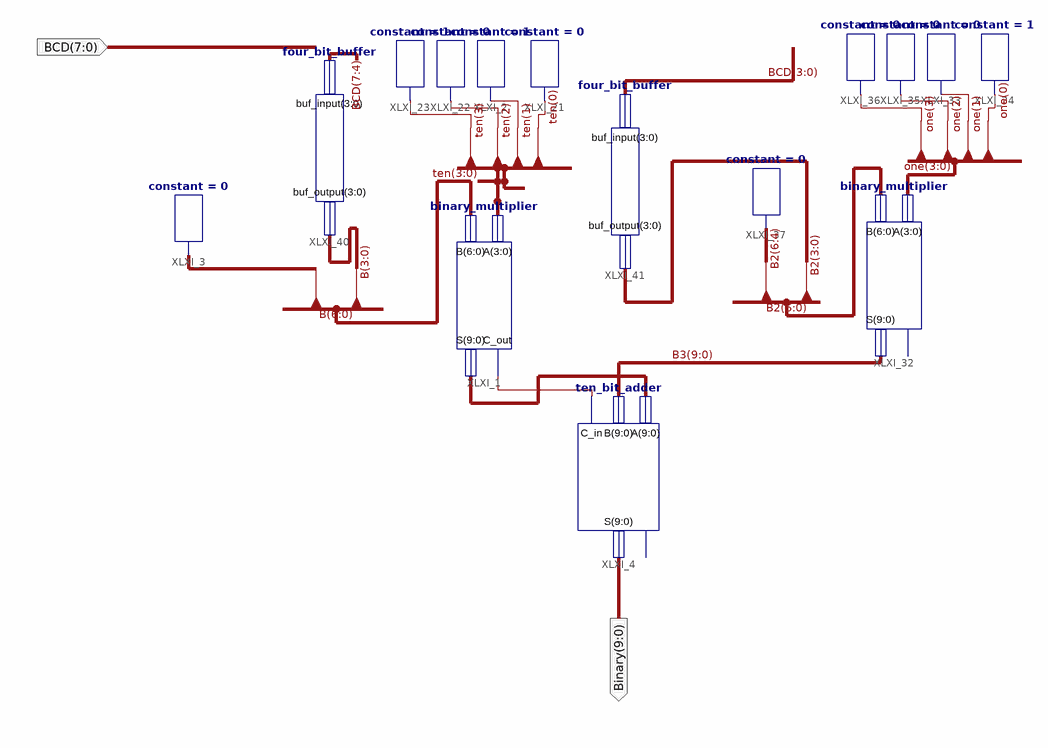
[diagram p0: schematic sheet 1]
// Xilinx ISE schematic BCD_to_Binary_decoder.sch (artix7) as structural Verilog: 15 symbols, 2 ports
module BCD_to_Binary_decoder (
  input  [7:0] BCD,
  output [9:0] Binary
);

  wire XLXN_10;
  wire [3:0] one, ten;
  wire [6:0] B, B2;
  wire [9:0] B3, XLXN_9;

  constant #(.CValue("1")) XLXI_2 (.O(ten[1]));
  constant #(.CValue("0")) XLXI_3 (.O(B[6:4]));
  binary_multiplier XLXI_1 (.A(ten), .B(B), .C_out(XLXN_10), .S(XLXN_9));
  constant #(.CValue("0")) XLXI_21 (.O(ten[0]));
  constant #(.CValue("0")) XLXI_22 (.O(ten[2]));
  constant #(.CValue("1")) XLXI_23 (.O(ten[3]));
  ten_bit_adder XLXI_4 (.A(XLXN_9), .B(B3), .C_in(XLXN_10), .S(Binary));  // open: C_out
  binary_multiplier XLXI_32 (.A(one), .B(B2), .S(B3));  // open: C_out
  constant #(.CValue("0")) XLXI_33 (.O(one[1]));
  constant #(.CValue("1")) XLXI_34 (.O(one[0]));
  constant #(.CValue("0")) XLXI_35 (.O(one[2]));
  constant #(.CValue("0")) XLXI_36 (.O(one[3]));
  constant #(.CValue("0")) XLXI_37 (.O(B2[6:4]));
  four_bit_buffer XLXI_40 (.buf_input(BCD[7:4]), .buf_output(B[3:0]));
  four_bit_buffer XLXI_41 (.buf_input(BCD[3:0]), .buf_output(B2[3:0]));
endmodule
